# EAGLE design midi-tester (EAGLE 7.7.0)
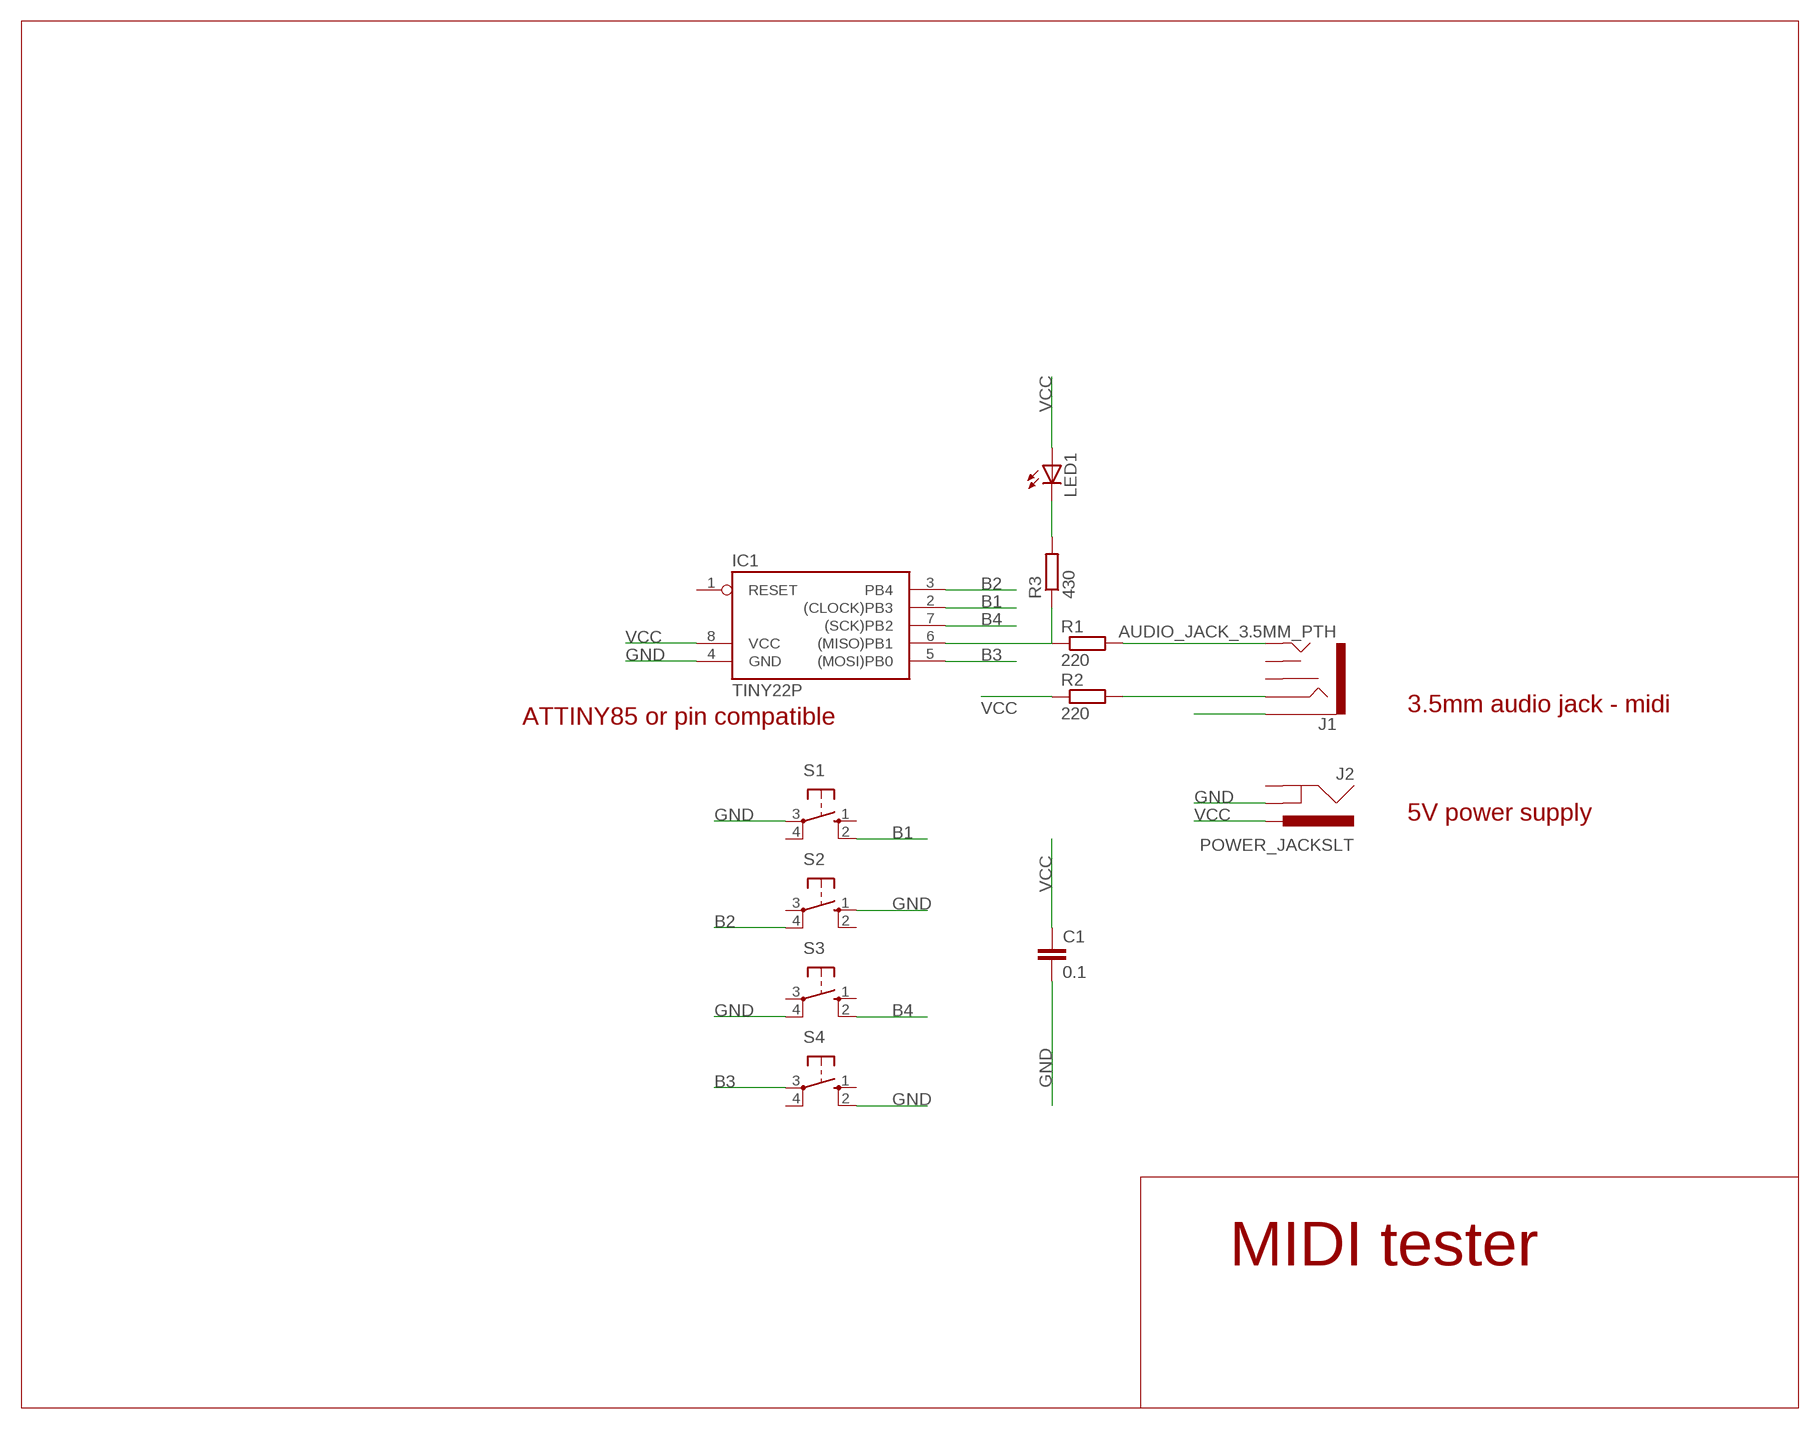
[diagram p0: schematic, sheet 1]

## Parts
C1  0.1  C-EUC0805  [C0805]
IC1  TINY22P  [DIL08]
J1  AUDIO_JACK_3.5MM_PTH  [AUDIO-JACK]
J2  POWER_JACKSLT  [POWER_JACK_SLOT]
LED1  LED5MM  [LED5MM]
R1  220  R-EU_R0805  [R0805]
R2  220  R-EU_R0805  [R0805]
R3  430  R-EU_R0805  [R0805]
S1  10-XX  [B3F-10XX]
S2  10-XX  [B3F-10XX]
S3  10-XX  [B3F-10XX]
S4  10-XX  [B3F-10XX]

## Nets
B1: IC1.2((CLOCK)PB3) S1.2(S1)
B2: IC1.3(PB4) S2.4(P1)
B3: IC1.5((MOSI)PB0) S4.3(P)
B4: IC1.7((SCK)PB2) S3.2(S1)
GND: C1.2 IC1.4(GND) J1.SLEEVE J2.GND@1(GNDBREAK) S1.3(P) S2.1(S) S3.4(P1) S4.2(S1)
N$1: IC1.6((MISO)PB1) R1.1 R3.1
N$2: J1.TIP R1.2
N$3: J1.RING R2.2
N$4: LED1.K(C) R3.2
VCC: C1.1 IC1.8(VCC) J2.PWR LED1.A R2.1
Unconnected: IC1.1(RESET) J1.RSH J1.TSH J2.GND@2(GND) S1.1(S) S1.4(P1) S2.2(S1) S2.3(P) S3.1(S) S3.3(P) S4.1(S) S4.4(P1)

## Notes on the sheet
- 3.5mm audio jack - midi
- ATTINY85 or pin compatible
- 5V power supply
- MIDI tester

## Library data of the parts
C1 = rcl:C-EU: CAPACITOR, European symbol
IC1 = atmel:TINY22: MICROCONTROLLER 1K ROM 128 bytes RAM 128 bytes EEPROM; OC_FARNELL: unknown; OC_NEWARK: unknown
J1 = SparkFun-Connectors:AUDIO_JACK_3.5MM: Audio Jack 3.5mm variants of PTH and SMT stereo audio jack with bypass switches. SparkFun Products: SparkFun SparkPunk Sound Kit <[https://www.sparkfun.com/products/11177]> - PTH MP3 Trigger <https://www.sparkfun.com/products/13720> -3.5mm SMD SparkFun PicoBoard <https://www.sparkfun.com/products/11888>- 2.5mm SMD; PROD_ID: CONN-08774; SF_ID: PRT-08032
J2 = SparkFun-Connectors:POWER_JACK: Power Jack Connector This is the standard 5.5mm barrel jack for power. The PTH is the most common, proven, reliable, footprint. The Slot footprint only works if the mill layer is transmitted to the PCB fab house so be warned. Here are the connectors we sell at SparkFun: DC Barrel Power Jack/Connector <https://www.sparkfun.com/products/119> (PRT-00119) DC Barrel Power Jack/Connector (SMD) <https://www.sparkfun.com/products/12748> (PRT-12748) DC Barrel Jack Adapter - Breadboard Compatible <https://www.sparkfun.com/products/10811> (PRT-10811) It is used on this SparkFun product (and many, many others): SparkFun RedBoard - Programmed with Arduino <https://www.sparkfun.com/products/12757> (DEV-12757) Also, if you need a mating power supply or connector, please check these out: Wall Adapter Power Supply - 9VDC 650mA <https://www.sparkfun.com/products/298> (TOL-00298) DC Barrel Jack Adapter - Male <https://www.sparkfun.com/products/10287> (PRT-10287); PROD_ID: PRT-00119
LED1 = led:LED: LED OSRAM: - CHIPLED LG R971, LG N971, LY N971, LG Q971, LY Q971, LO R971, LY R971 LH N974, LH R974 LS Q976, LO Q976, LY Q976 LO Q996 - Hyper CHIPLED LW Q18S LB Q993, LB Q99A, LB R99A - SideLED LS A670, LO A670, LY A670, LG A670, LP A670 LB A673, LV A673, LT A673, LW A673 LH A674 LY A675 LS A676, LA A676, LO A676, LY A676, LW A676 LS A679, LY A679, LG A679 - Hyper Micro SIDELED® LS Y876, LA Y876, LO Y876, LY Y876 LT Y87S - SmartLED LW L88C, LW L88S LB L89C, LB L89S, LG L890 LS L89K, LO L89K, LY L89K LS L896, LA L896, LO L896, LY L896 - TOPLED LS T670, LO T670, LY T670, LG T670, LP T670 LSG T670, LSP T670, LSY T670, LOP T670, LYG T670 LG T671, LOG T671, LSG T671 LB T673, LV T673, LT T673, LW T673 LH T674 LS T676, LA T676, LO T676, LY T676, LB T676, LH T676, LSB T676, LW T676 LB T67C, LV T67C, LT T67C, LS T67K, LO T67K, LY T67K, LW E67C LS E67B, LA E67B, LO E67B, LY E67B, LB E67C, LV E67C, LT E67C LW T67C LS T679, LY T679, LG T679 LS T770, LO T770, LY T770, LG T770, LP T770 LB T773, LV T773, LT T773, LW T773 LH T774 LS E675, LA E675, LY E675, LS T675 LS T776, LA T776, LO T776, LY T776, LB T776 LHGB T686 LT T68C, LB T68C - Hyper Mini TOPLED® LB M676 - Mini TOPLED Santana® LG M470 LS M47K, LO M47K, LY M47K Source: http://www.osram.convergy.de LUXEON: - LUMILED® LXK2-PW12-R00, LXK2-PW12-S00, LXK2-PW14-U00, LXK2-PW14-V00 LXK2-PM12-R00, LXK2-PM12-S00, LXK2-PM14-U00 LXK2-PE12-Q00, LXK2-PE12-R00, LXK2-PE12-S00, LXK2-PE14-T00, LXK2-PE14-U00 LXK2-PB12-K00, LXK2-PB12-L00, LXK2-PB12-M00, LXK2-PB14-N00, LXK2-PB14-P00, LXK2-PB14-Q00 LXK2-PR12-L00, LXK2-PR12-M00, LXK2-PR14-Q00, LXK2-PR14-R00 LXK2-PD12-Q00, LXK2-PD12-R00, LXK2-PD12-S00 LXK2-PH12-R00, LXK2-PH12-S00 LXK2-PL12-P00, LXK2-PL12-Q00, LXK2-PL12-R00 Source: www.luxeon.com KINGBRIGHT: KA-3528ASYC Source: www.kingbright.com
R1-R3 = rcl:R-EU_: RESISTOR, European symbol
S1-S4 = switch-omron:10-XX: OMRON SWITCH; MPN: B3F-1000; OC_FARNELL: 176432; OC_NEWARK: 36M3542

## Board
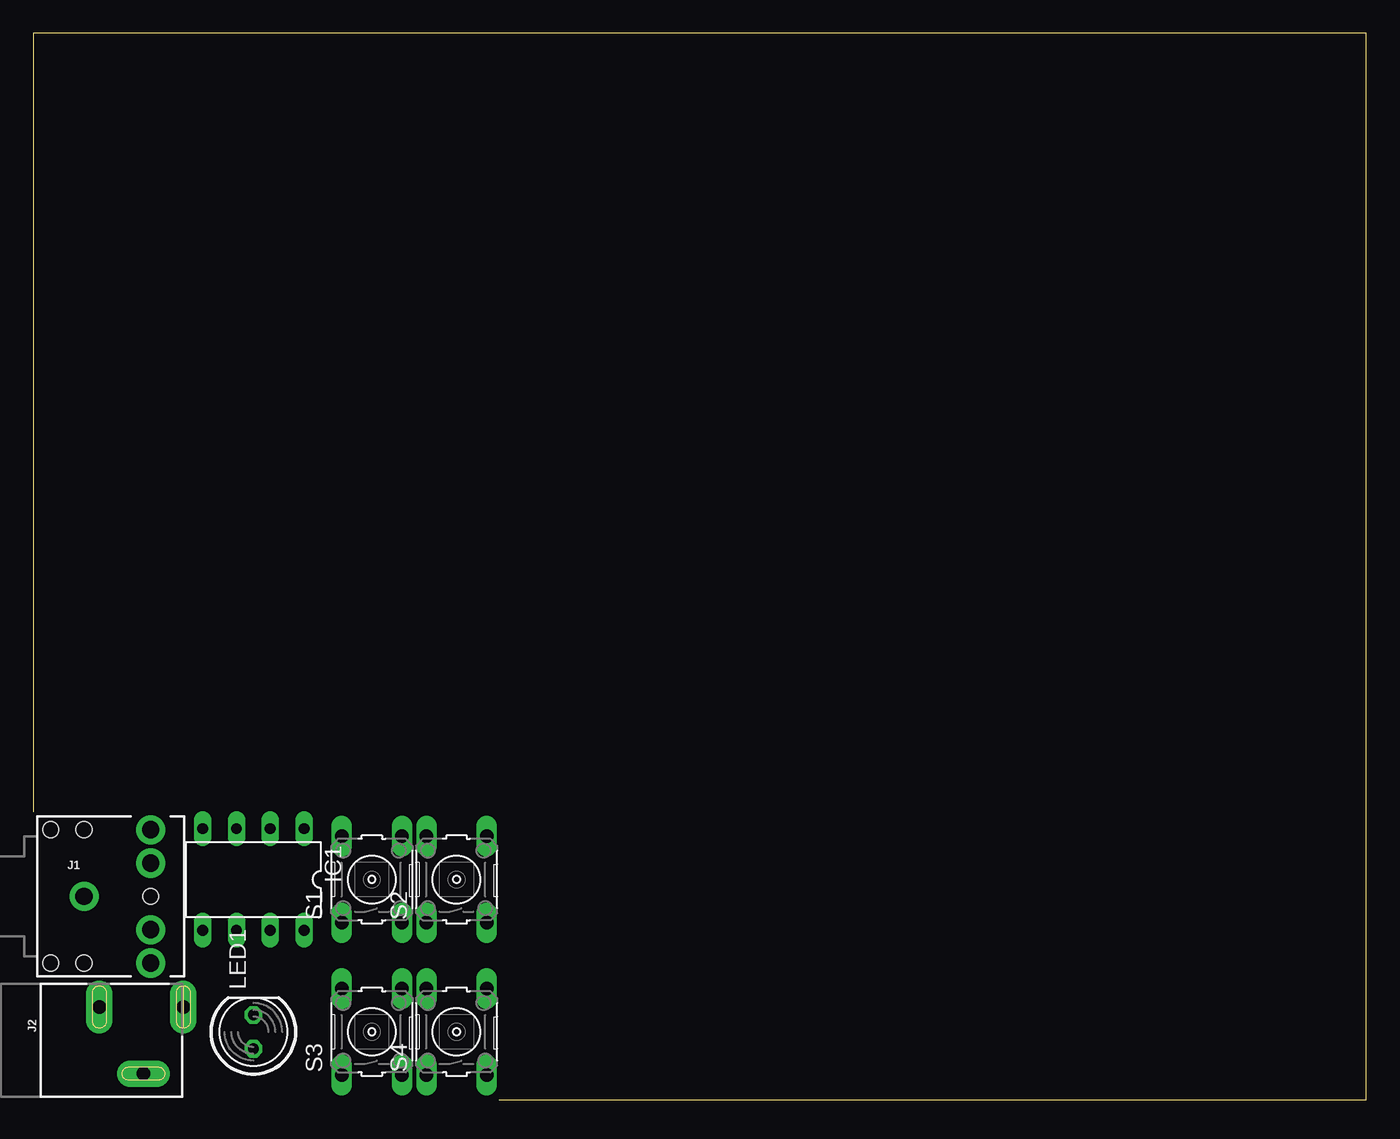
[diagram p1: board, top side]
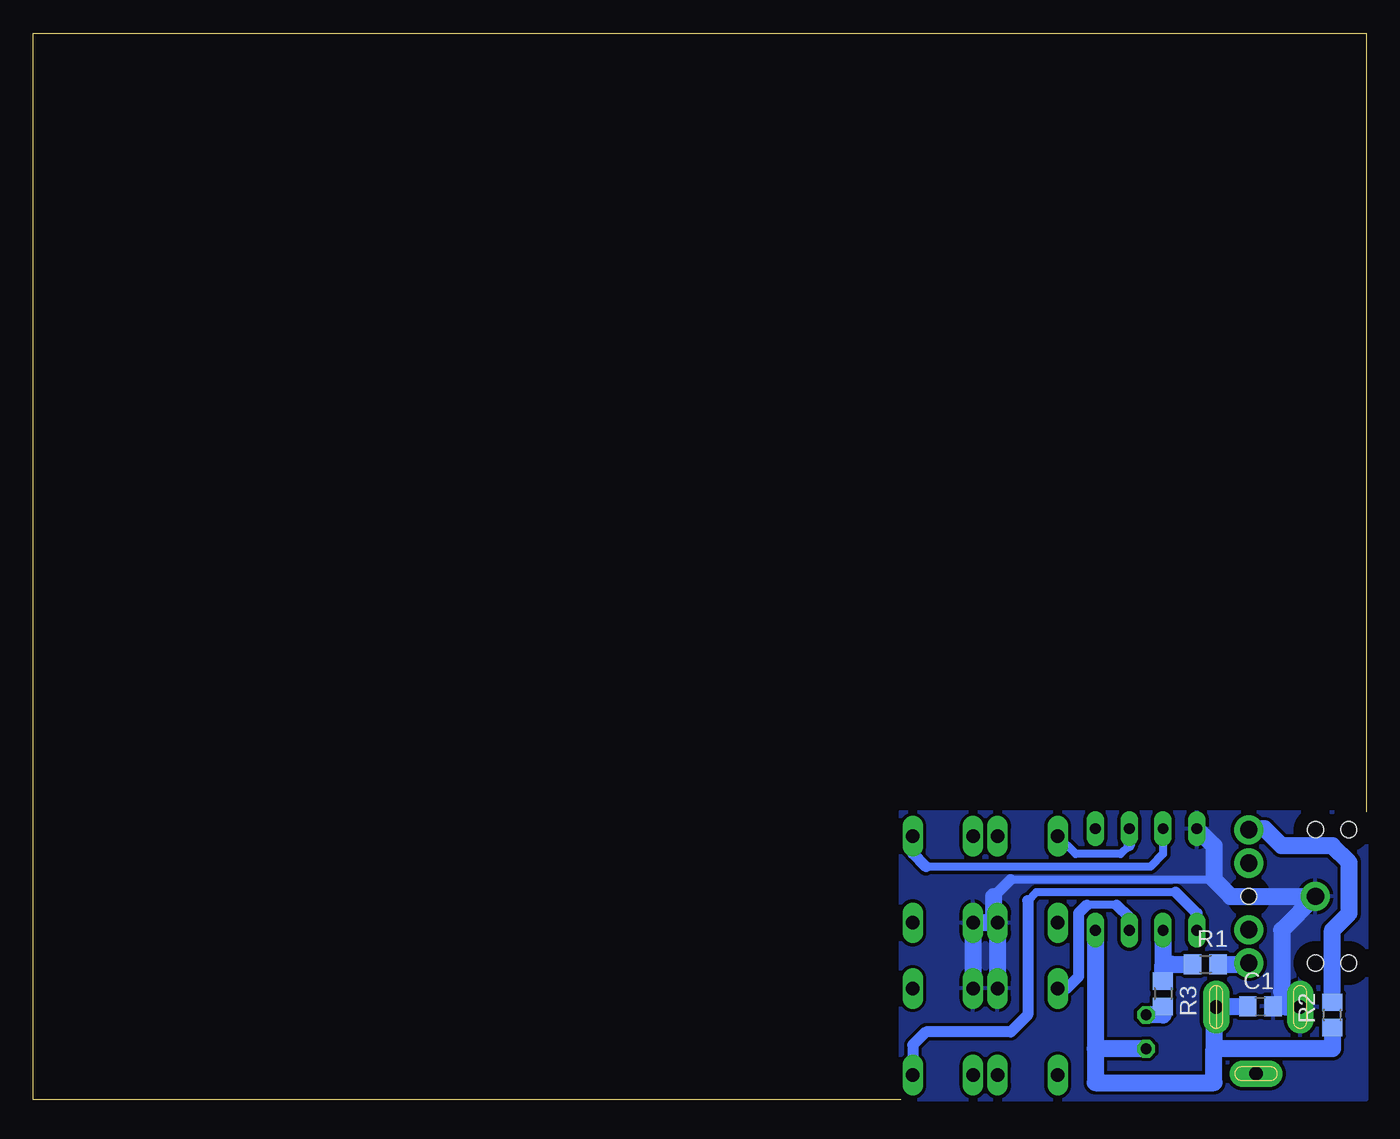
[diagram p2: board, bottom side, seen from below]

Size 100 x 80 mm. Coordinates in mm from the lower left corner, seen from the top.
Outline: 34.92,0 100,0 100,80 0,80 0,21.59
Copper layers (1*16): Top 0.035mm / dielectric 1.5mm / Bottom 0.035mm
Design rules "default": minimum track width 10mil, minimum drill 24mil, track to track 8mil, track to pad 8mil, pad to pad 8mil, via to via 8mil, smd to smd 8mil, copper to edge 40mil, drill to drill 8mil, minimum pad ring 10mil, minimum via ring 8mil, stop-mask expansion 4mil, vias tented up to drill 0mil, thermal gap 10mil

### Footprints (pad centres in the part's own frame; a part is rotated, then mirrored left to right if it is on the bottom)
C0805 = smd 1.3 x 1.5: 1 -0.95,0; 2 0.95,0
DIL08 = drill 0.813 long: 1 -3.81,-3.81; 2 -1.27,-3.81; 3 1.27,-3.81; 4 3.81,-3.81; 5 3.81,3.81; 6 1.27,3.81; 7 -1.27,3.81; 8 -3.81,3.81
AUDIO-JACK = drill 1.3 pad 2.184: RING 5,5; RSH 5,2.5; SLEEVE 0,0; TIP 5,-5; TSH 5,-2.5 | hole 1.2: 0,5; -2.5,5; -2.5,-5; 0,-5; 5,0
POWER_JACK_SLOT = drill 1 pad 2 long: GND@1 2.58,7.5; GND@2 7.58,10.8; PWR 2.58,13.8
LED5MM = drill 0.813 octagon: A -1.27,0; K 1.27,0
R0805 = smd 1.3 x 1.5: 1 -0.95,0; 2 0.95,0
B3F-10XX = drill 1.016 long: 1 -3.251,2.261; 2 3.251,2.261; 3 -3.251,-2.261; 4 3.251,-2.261

### Placement (x,y rotation side)
C1  7.94,6.99 0 bottom
IC1  16.51,16.51 180 top
J1  3.81,15.24 0 top
J2  -2.54,9.53 270 top
LED1  16.51,5.08 90 top
R1  12.06,10.16 0 bottom
R2  2.54,6.35 90 bottom
R3  15.24,7.94 270 bottom
S1  25.4,16.51 90 top
S2  31.75,16.51 90 top
S3  25.4,5.08 90 top
S4  31.75,5.08 90 top

### Tracks (layer width: path | path; a pad name or v marks a point on that pad's centre or on a via)
B1
  Bottom 0.61: 17.78,19.05 18.41,18.41 21.79,18.41 S1.2
  Bottom 0.813: IC1.2 17.78,19.05
B2
  Bottom 0.61: IC1.3 15.24,18.41 16.19,17.46 33.02,17.46
  Bottom 0.813: 33.02,17.46 34.01,18.45 S2.4
B3
  Bottom 0.61: 14.29,15.56 24.77,15.56 25.4,14.92
  Bottom 0.813: IC1.5 12.7,13.97 14.29,15.56 | 25.4,14.92 25.4,6.35 26.67,5.08 33.02,5.08 34.01,4.09 S4.3
B4
  Bottom 0.61: 18.73,14.61 20.95,14.61
  Bottom 0.813: IC1.7 17.78,13.65 18.73,14.61 | 20.95,14.61 21.59,13.97 21.59,9.21 22.47,8.33 S3.2
GND
  Bottom 0.61: 26.67,16.51 11.43,16.51
  Bottom 0.813: 27.94,15.24 26.67,16.51
  Bottom 1.27: S4.2 S2.1 S1.3 | S1.3 S3.4 | S1.3 27.94,13.54 27.94,15.24 | IC1.4 11.43,19.05 11.43,16.51 10.16,15.24 J1.SLEEVE 6.35,12.7 6.35,8.1 J2.GND@1 6,6.95 C1.2
  pour Bottom (isolate 0.254): 0,0 34.92,0 34.92,21.59 0,21.59
N$1
  Bottom 1.27: IC1.6 15.24,10.16 | 14.61,10.16 R1.1 15.24,10.16 | R3.1 15.24,10.16
N$2
  Bottom 1.27: R1.2 8.81,10.16 J1.TIP
N$3
  Bottom 1.27: R2.2 2.54,12.7 1.27,13.97 1.27,17.78 2.54,19.05 6.35,19.05 7.62,20.32 8.73,20.32 J1.RING
N$4
  Bottom 1.27: R3.2 15.24,6.35 LED1.K
VCC
  Bottom 1.27: R2.1 2.54,3.81 11.43,3.81 | IC1.8 20.32,3.81 | 20.32,3.81 20.32,1.27 11.43,1.27 11.43,3.81 | LED1.A 20.32,3.81 | C1.1 10.59,6.99 J2.PWR 11.43,6.95 11.43,3.81